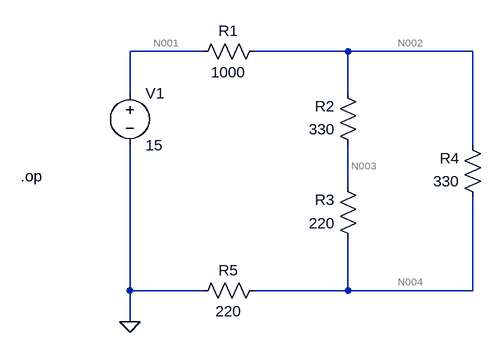
[diagram p0: schematic lab4.asc]
lab4.asc, the LTspice schematic file:
Version 4
SHEET 1 880 680
WIRE 80 48 -32 48
WIRE 304 48 160 48
WIRE 496 48 304 48
WIRE -32 112 -32 48
WIRE 304 112 304 48
WIRE 496 192 496 48
WIRE 304 256 304 192
WIRE -32 416 -32 192
WIRE 80 416 -32 416
WIRE 304 416 304 336
WIRE 304 416 160 416
WIRE 496 416 496 272
WIRE 496 416 304 416
WIRE -32 464 -32 416
FLAG -32 464 0
SYMBOL voltage -32 96 R0
WINDOW 123 0 0 Left 0
WINDOW 39 0 0 Left 0
SYMATTR InstName V1
SYMATTR Value 15
SYMBOL res 176 32 R90
WINDOW 0 0 56 VBottom 2
WINDOW 3 32 56 VTop 2
SYMATTR InstName R1
SYMATTR Value 1000
SYMBOL res 320 208 R180
WINDOW 0 36 76 Left 2
WINDOW 3 36 40 Left 2
SYMATTR InstName R2
SYMATTR Value 330
SYMBOL res 320 352 R180
WINDOW 0 36 76 Left 2
WINDOW 3 36 40 Left 2
SYMATTR InstName R3
SYMATTR Value 220
SYMBOL res 512 288 R180
WINDOW 0 36 76 Left 2
WINDOW 3 36 40 Left 2
SYMATTR InstName R4
SYMATTR Value 330
SYMBOL res 64 432 R270
WINDOW 0 32 56 VTop 2
WINDOW 3 0 56 VBottom 2
SYMATTR InstName R5
SYMATTR Value 220
TEXT -200 240 Left 2 !.op

The netlist it stands for:
* lab4.asc
V1 N001 0 15
R1 N002 N001 1000
R2 N003 N002 330
R3 N004 N003 220
R4 N004 N002 330
R5 0 N004 220
.op
.backanno
.end

* Results of the author's LTspice run, read from the files saved beside the schematic
* Operating Point:
*   V(n001) = 15 V
*   V(n002) = 4.483 V
*   V(n003) = 3.181 V
*   V(n004) = 2.314 V
*   I(R5) = -10.52 mA
*   I(R4) = -6.573 mA
*   I(R3) = -3.944 mA
*   I(R2) = -3.944 mA
*   I(R1) = -10.52 mA
*   I(V1) = -10.52 mA